# EAGLE design brick_analog_humidity (EAGLE 7.3.0)
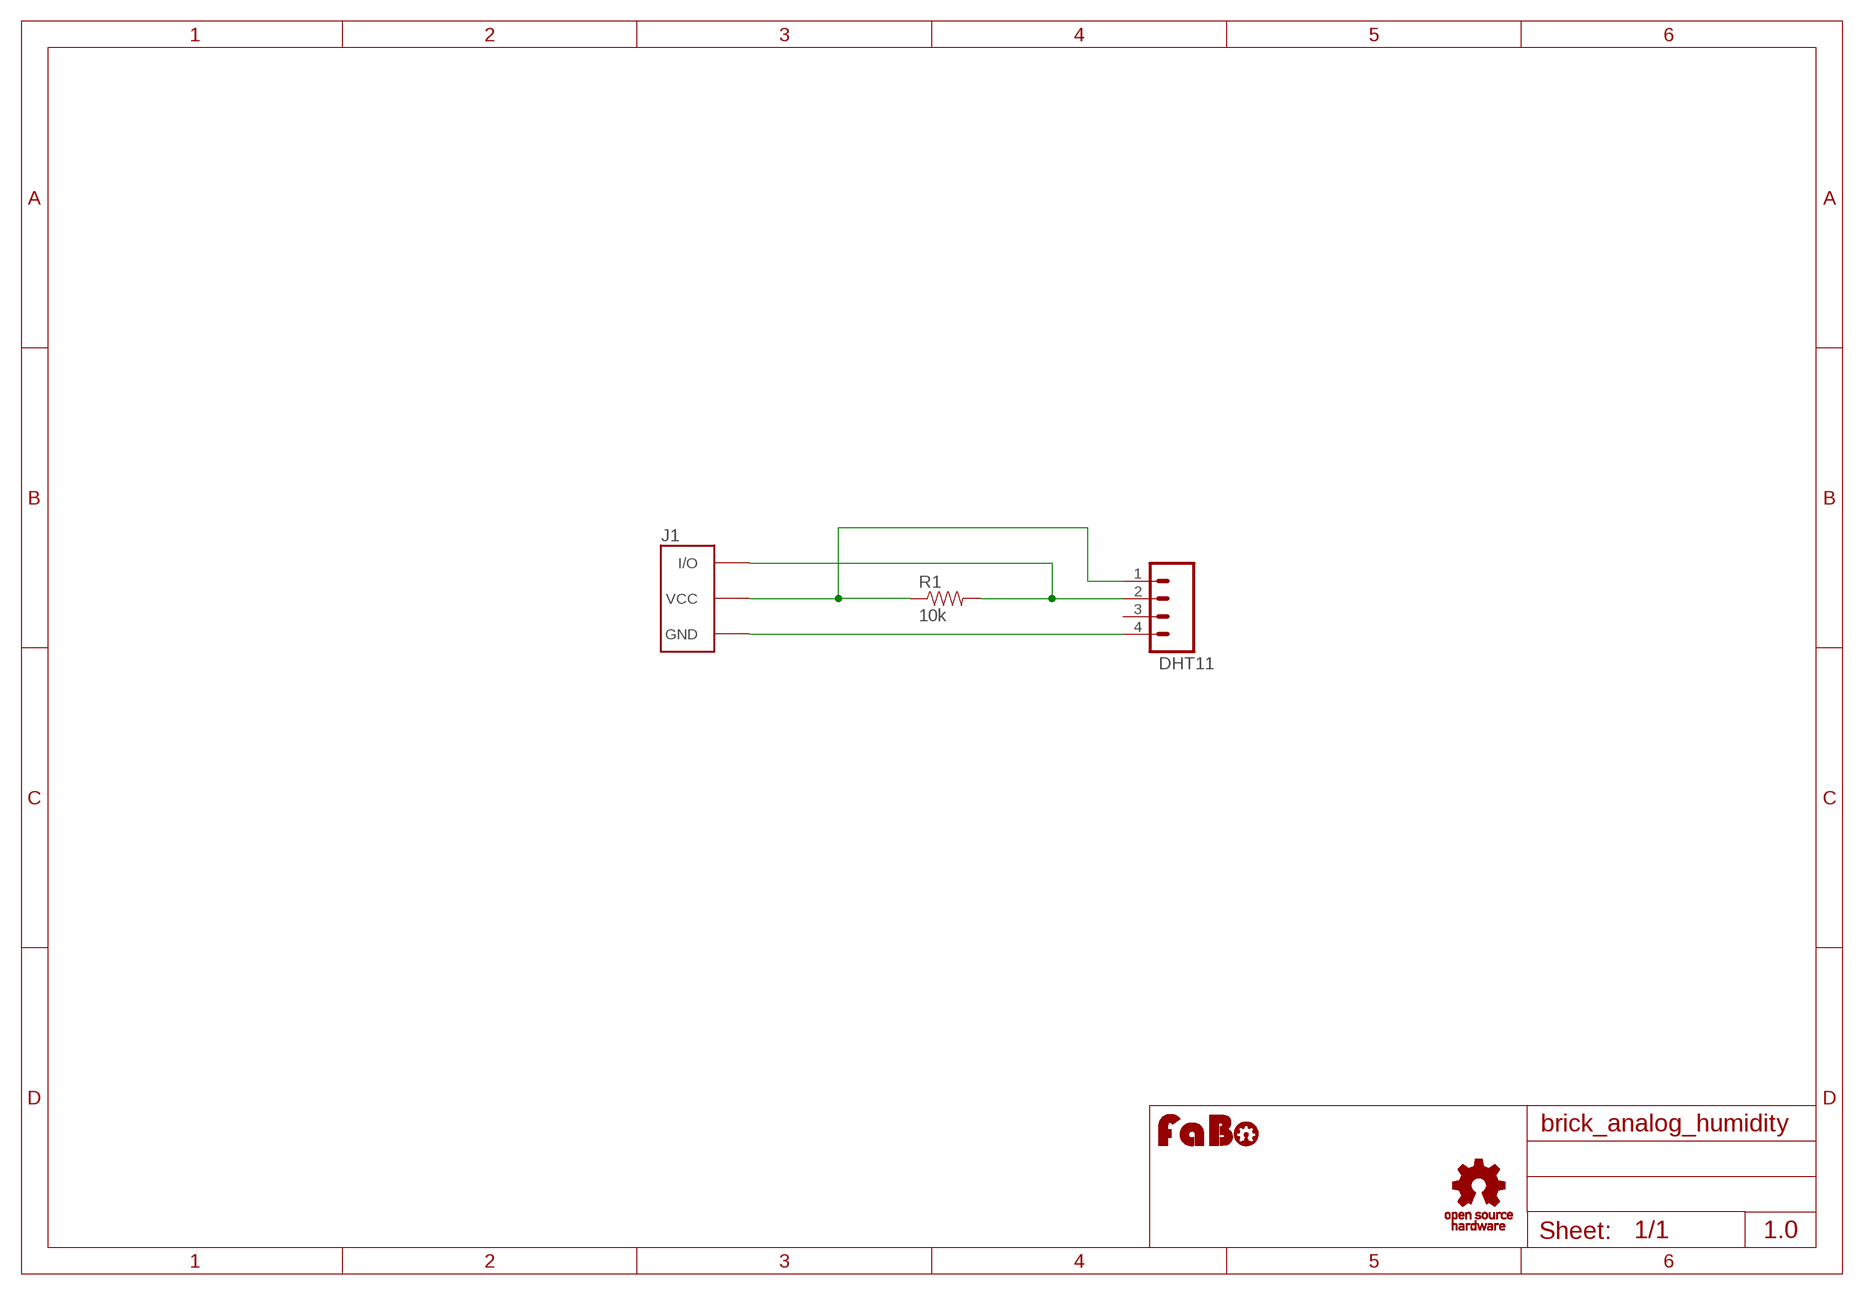
[diagram p0: schematic, sheet 1]

## Parts
J1  BRICK_3PIN_NORMAL  [BRICK_3PIN]
JP1  DHT11  M04LONGPADS  [1X04_LONGPADS]
R1  10k  RES-PTH-REGULAR  [RES-AXL-REGULAR]
U$1  LOGO_FABO-M  [LOGO_FABO_M]
U$4  LOGO_OSHW_T-M  [LOGO_OSHW_T_M]

## Nets
GND: J1.GND JP1.4
N$3: J1.IN/OUT(I/O) JP1.2 R1.P$2
N$5: J1.VCC JP1.1 R1.P$1
Unconnected: JP1.3

## Notes on the sheet
- 1.0

## Library data of the parts
J1 = gclue:BRICK_3PIN: FaBo Brick 3pin
JP1 = SparkFun-Connectors:M04: Header 4 Standard 4-pin 0.1" header. Use with straight break away headers (SKU : PRT-00116), right angle break away headers (PRT-00553), swiss pins (PRT-00743), machine pins (PRT-00117), and female headers (PRT-00115). Molex polarized connector foot print use with SKU : PRT-08231 with associated crimp pins and housings. 1MM SMD Version SKU: PRT-10208
R1 = gclue:RES
U$1 = FaBo:LOGO_FABO
U$4 = gclue:LOGO_OSHW_T

## Board
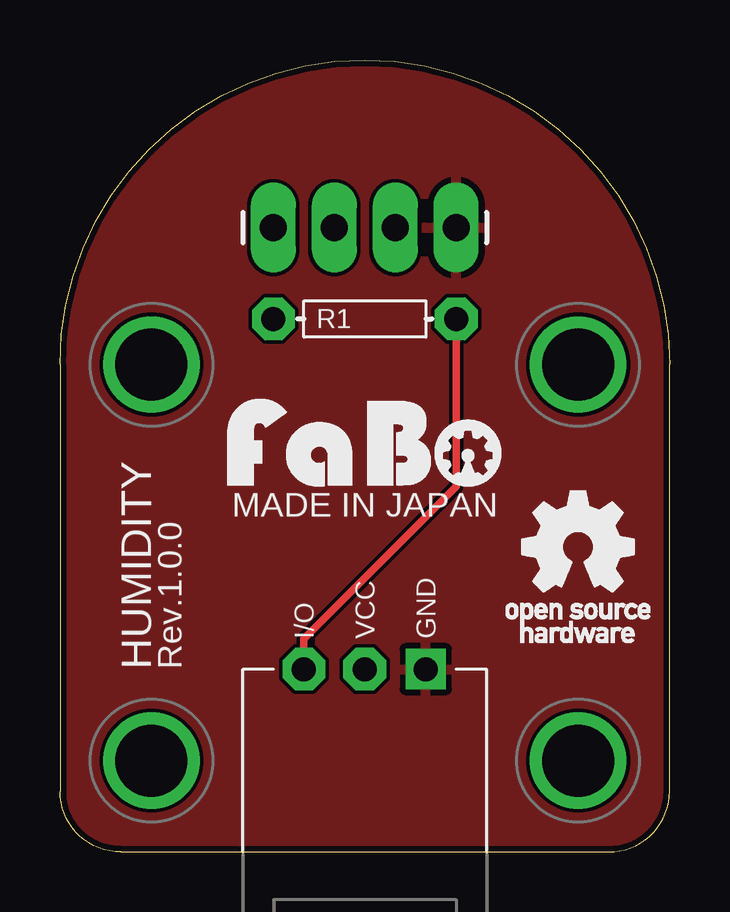
[diagram p1: board, top side]
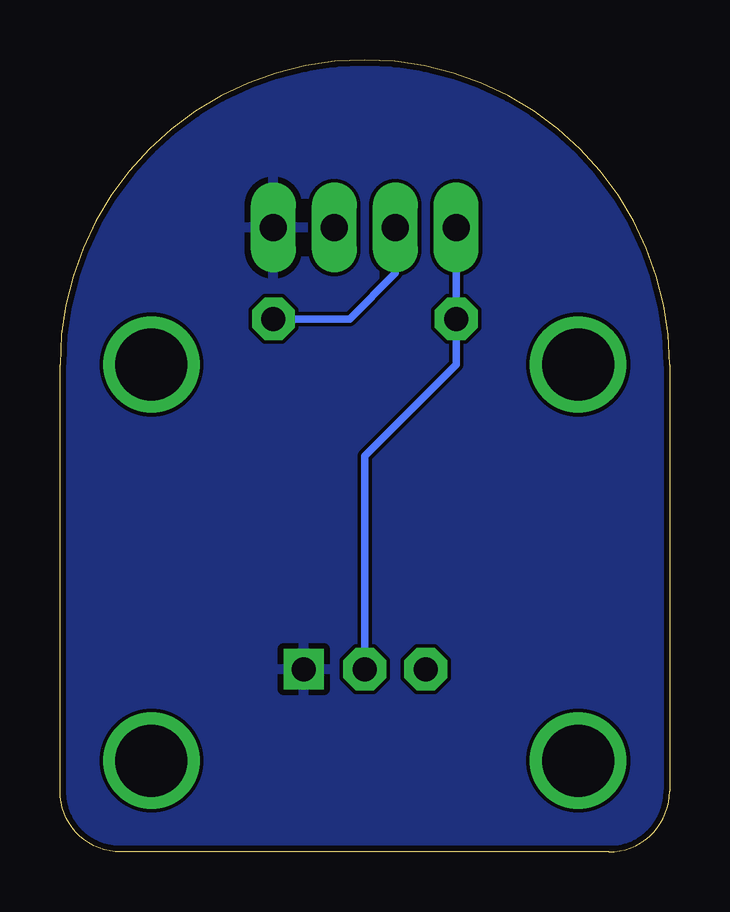
[diagram p2: board, bottom side, seen from below]

Size 25.4 x 33.02 mm. Coordinates in mm from the lower left corner, seen from the top.
Copper layers (1*16): Top 0.035mm / dielectric 1.5mm / Bottom 0.035mm
Design rules "Elecrow_2-layer_eagle_rule": minimum track width 6mil, minimum drill 12mil, track to track 6mil, track to pad 6mil, pad to pad 6mil, via to via 6mil, smd to smd 0mil, copper to edge 10mil, drill to drill 10mil, minimum pad ring 10mil, minimum via ring 6mil, stop-mask expansion 2mil, vias tented up to drill 100mil, thermal gap 10mil

### Footprints (pad centres in the part's own frame; a part is rotated, then mirrored left to right if it is on the bottom)
BRICK_3PIN = drill 1 pad 1.676 square: GND 2.54,-8.89 | drill 1 pad 1.778 octagon: IN/OUT -2.54,-8.89; VCC 0,-8.89 | drill 3 pad 3.81: P$5 -8.89,3.81; P$6 8.89,3.81; P$7 -8.89,-12.7; P$8 8.89,-12.7
1X04_LONGPADS = drill 1.118 pad 1.88 long: 1 0,0; 2 2.54,0; 3 5.08,0; 4 7.62,0
RES-AXL-REGULAR = drill 1 pad 1.778 octagon: P$1 -3.81,0; P$2 3.81,0

### Placement (x,y rotation side)
J1  12.7,16.51 0 top
JP1  8.89,26.04 0 top
R1  12.7,22.23 0 top
U$2  [LOGO_OSHW_T_M]  21.59,12.7 0 top
U$3  [LOGO_FABO_M]  12.7,15.24 0 top

### Tracks (layer width: path | path; a pad name or v marks a point on that pad's centre or on a via)
GND
  pour Bottom: -1.27,-1.27 26.67,-1.27 26.67,34.29 -1.27,34.29
  pour Top: -1.27,-1.27 26.67,-1.27 26.67,34.29 -1.27,34.29
N$3
  Top 0.305: J1.IN/OUT 10.16,8.89 16.51,15.24 R1.P$2
  Bottom 0.305: R1.P$2 13.34,22.23 11.43,24.13 JP1.2
N$5
  Bottom 0.305: JP1.1 R1.P$1 8.89,20.32 12.7,16.51 J1.VCC

### Text on the board
tPlace: MADE IN JAPAN | HUMIDITY | Rev.1.0.0